# Altium schematic sheet Top Level Schematic.SchDoc
size E; DocumentNumber: 1; SheetNumber: 1; SheetTotal: 4
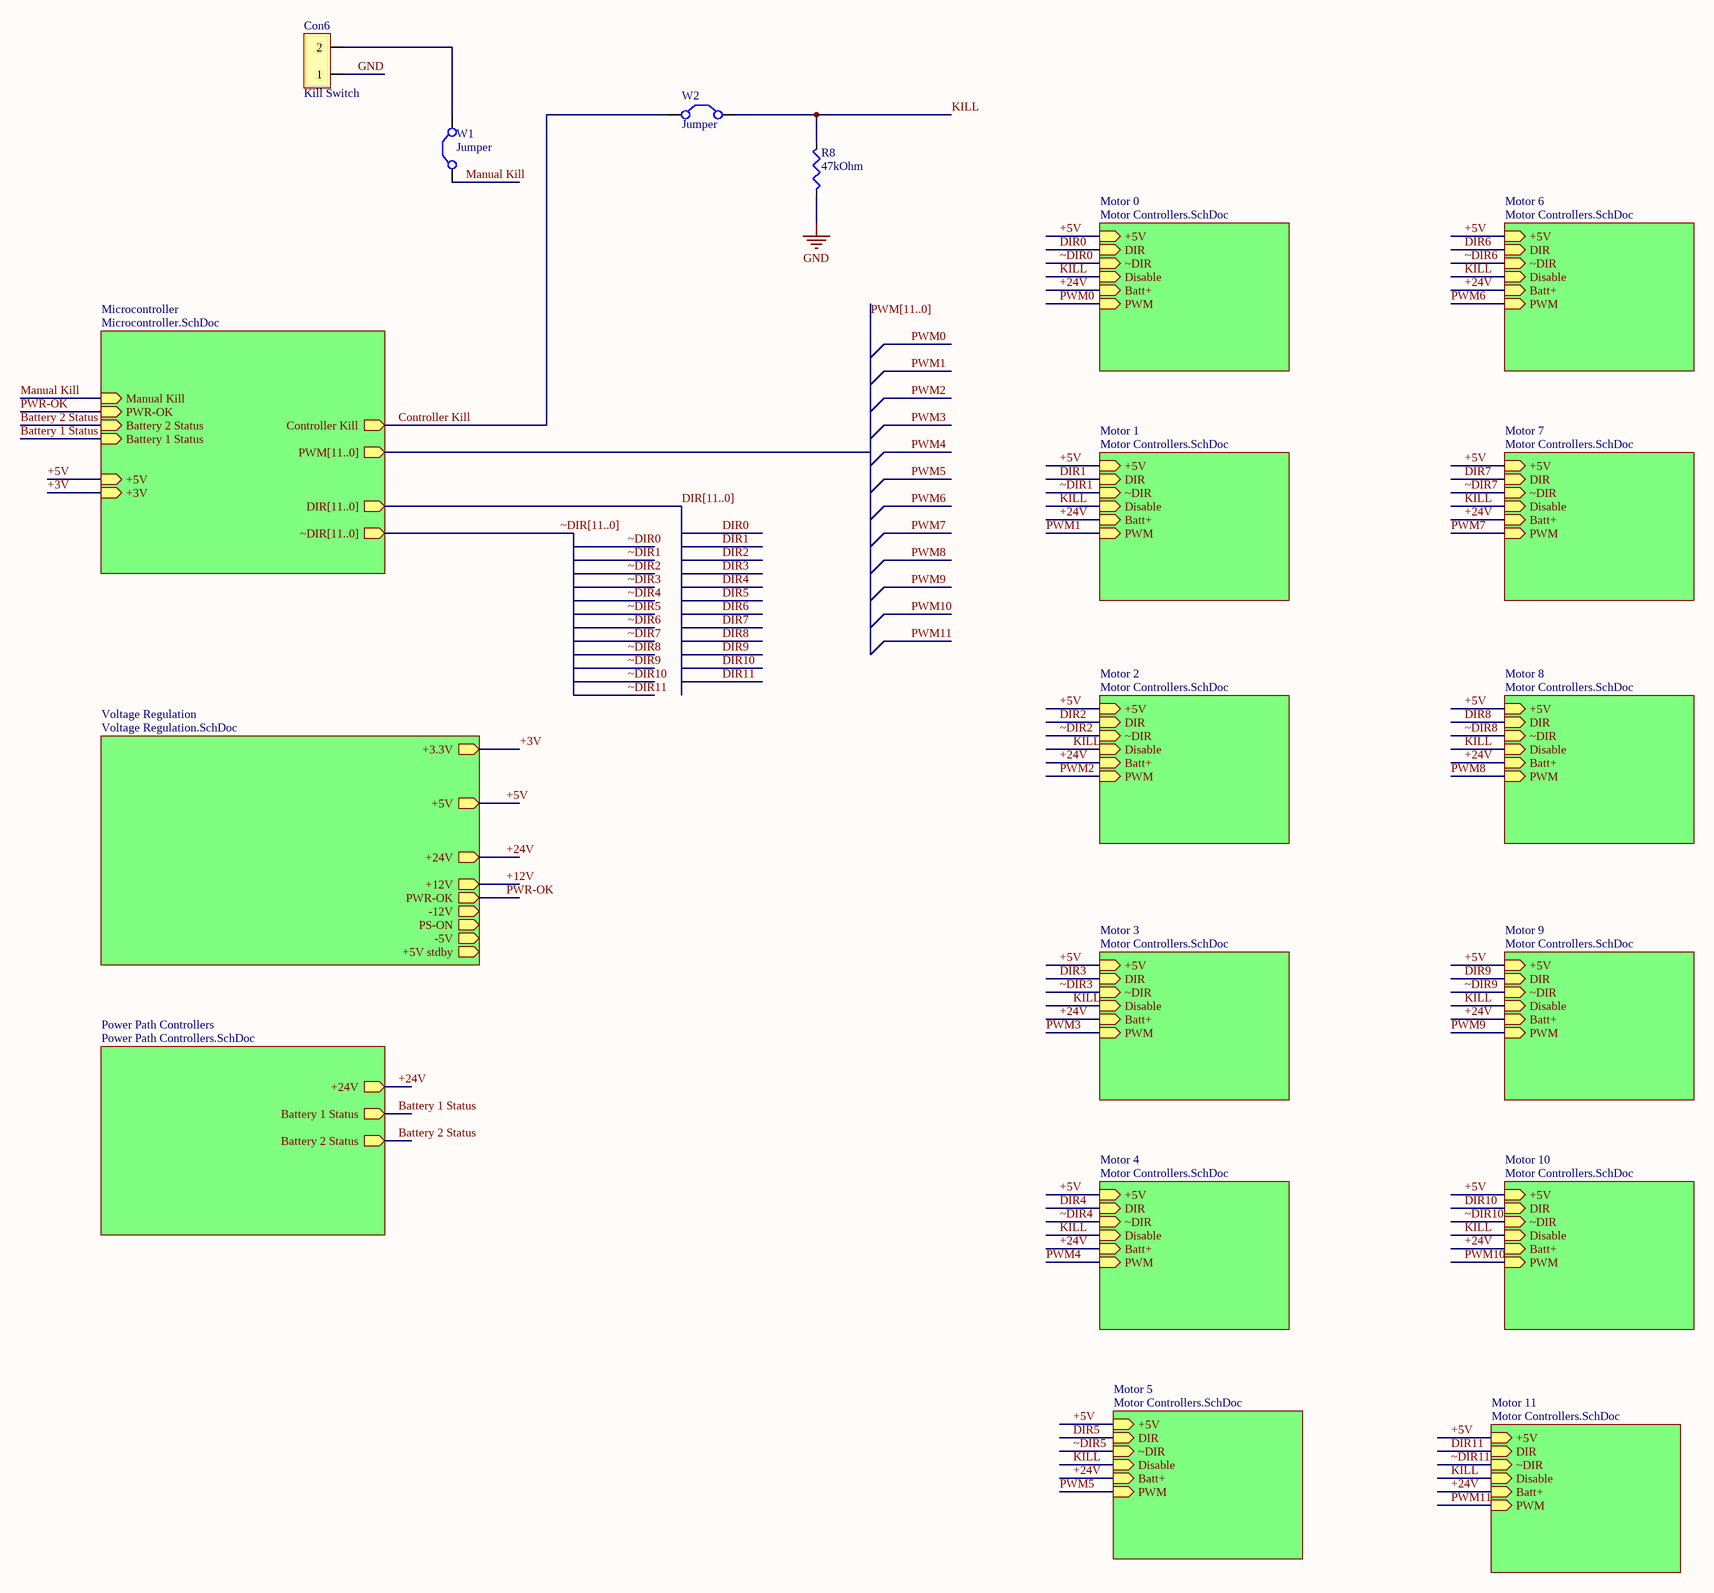
[diagram p0: Top Level Schematic.SchDoc]

## Parts
Con6  Kill Switch  [5569 Mini-Fit Jr 2-Pos Right Angle w/ PCB Mounting Flange]
R8  47kOhm  [R 1210 (3225) RESISTOR]
W1  Jumper  [RAD-0.2]
W2  Jumper  [RAD-0.2]

## Sub-sheets
Microcontroller = Microcontroller.SchDoc: PWM[11..0] (out), DIR[11..0] (out), +5V (in), ~DIR[11..0] (out), +3V (in), Controller Kill (out), Battery 1 Status (in), Battery 2 Status (in), PWR-OK (in), Manual Kill (in)
Motor 0 = Motor Controllers.SchDoc: DIR (in), ~DIR (in), Disable (in), Batt+ (in), PWM (in), +5V (in)
Motor 1 = Motor Controllers.SchDoc: DIR (in), ~DIR (in), Disable (in), Batt+ (in), PWM (in), +5V (in)
Motor 2 = Motor Controllers.SchDoc: DIR (in), ~DIR (in), Disable (in), Batt+ (in), PWM (in), +5V (in)
Motor 3 = Motor Controllers.SchDoc: DIR (in), ~DIR (in), Disable (in), Batt+ (in), PWM (in), +5V (in)
Motor 4 = Motor Controllers.SchDoc: DIR (in), ~DIR (in), Disable (in), Batt+ (in), PWM (in), +5V (in)
Motor 5 = Motor Controllers.SchDoc: DIR (in), ~DIR (in), Disable (in), Batt+ (in), PWM (in), +5V (in)
Motor 6 = Motor Controllers.SchDoc: DIR (in), ~DIR (in), Disable (in), Batt+ (in), PWM (in), +5V (in)
Motor 7 = Motor Controllers.SchDoc: DIR (in), ~DIR (in), Disable (in), Batt+ (in), PWM (in), +5V (in)
Motor 8 = Motor Controllers.SchDoc: DIR (in), ~DIR (in), Disable (in), Batt+ (in), PWM (in), +5V (in)
Motor 9 = Motor Controllers.SchDoc: DIR (in), ~DIR (in), Disable (in), Batt+ (in), PWM (in), +5V (in)
Motor 10 = Motor Controllers.SchDoc: DIR (in), ~DIR (in), Disable (in), Batt+ (in), PWM (in), +5V (in)
Motor 11 = Motor Controllers.SchDoc: DIR (in), ~DIR (in), Disable (in), Batt+ (in), PWM (in), +5V (in)
Power Path Controllers = Power Path Controllers.SchDoc: +24V (out), Battery 1 Status (out), Battery 2 Status (out)
Voltage Regulation = Voltage Regulation.SchDoc: +3.3V (out), +5V (out), +12V (out), PWR-OK (out), -12V (out), PS-ON (out), -5V (out), +5V stdby (out), +24V (out)

## Nets
GND: Con6.1 R8.1
+3V: sheet Microcontroller/+3V, sheet Voltage Regulation/+3.3V
+5V: sheet Microcontroller/+5V, sheet Motor 0/+5V, sheet Motor 1/+5V, sheet Motor 2/+5V, sheet Motor 3/+5V, sheet Motor 4/+5V, sheet Motor 5/+5V, sheet Motor 6/+5V, sheet Motor 7/+5V, sheet Motor 8/+5V, sheet Motor 9/+5V, sheet Motor 11/+5V, sheet Motor 10/+5V, sheet Voltage Regulation/+5V
+12V: sheet Voltage Regulation/+12V
+24V: sheet Motor 0/Batt+, sheet Motor 1/Batt+, sheet Motor 2/Batt+, sheet Motor 3/Batt+, sheet Motor 4/Batt+, sheet Motor 5/Batt+, sheet Motor 6/Batt+, sheet Motor 7/Batt+, sheet Motor 8/Batt+, sheet Motor 9/Batt+, sheet Motor 11/Batt+, sheet Motor 10/Batt+, sheet Voltage Regulation/+24V, sheet Power Path Controllers/+24V
Battery 1 Status: sheet Microcontroller/Battery 1 Status, sheet Power Path Controllers/Battery 1 Status
Battery 2 Status: sheet Microcontroller/Battery 2 Status, sheet Power Path Controllers/Battery 2 Status
Controller Kill: W2.1(C1) ; sheet Microcontroller/Controller Kill
DIR0: sheet Motor 0/DIR
DIR1: sheet Motor 1/DIR
DIR2: sheet Motor 2/DIR
DIR3: sheet Motor 3/DIR
DIR4: sheet Motor 4/DIR
DIR5: sheet Motor 5/DIR
DIR6: sheet Motor 6/DIR
DIR7: sheet Motor 7/DIR
DIR8: sheet Motor 8/DIR
DIR9: sheet Motor 9/DIR
DIR10: sheet Motor 10/DIR
DIR11: sheet Motor 11/DIR
KILL: R8.2 W2.2(C2) ; sheet Motor 0/Disable, sheet Motor 1/Disable, sheet Motor 2/Disable, sheet Motor 3/Disable, sheet Motor 4/Disable, sheet Motor 5/Disable, sheet Motor 6/Disable, sheet Motor 7/Disable, sheet Motor 8/Disable, sheet Motor 9/Disable, sheet Motor 11/Disable, sheet Motor 10/Disable
Manual Kill: W1.1(C1) ; sheet Microcontroller/Manual Kill
PWM0: sheet Motor 0/PWM
PWM1: sheet Motor 1/PWM
PWM2: sheet Motor 2/PWM
PWM3: sheet Motor 3/PWM
PWM4: sheet Motor 4/PWM
PWM5: sheet Motor 5/PWM
PWM6: sheet Motor 6/PWM
PWM7: sheet Motor 7/PWM
PWM8: sheet Motor 8/PWM
PWM9: sheet Motor 9/PWM
PWM10: sheet Motor 10/PWM
PWM11: sheet Motor 11/PWM
PWR-OK: sheet Microcontroller/PWR-OK, sheet Voltage Regulation/PWR-OK
~DIR0: sheet Motor 0/~DIR
~DIR1: sheet Motor 1/~DIR
~DIR2: sheet Motor 2/~DIR
~DIR3: sheet Motor 3/~DIR
~DIR4: sheet Motor 4/~DIR
~DIR5: sheet Motor 5/~DIR
~DIR6: sheet Motor 6/~DIR
~DIR7: sheet Motor 7/~DIR
~DIR8: sheet Motor 8/~DIR
~DIR9: sheet Motor 9/~DIR
~DIR10: sheet Motor 10/~DIR
~DIR11: sheet Motor 11/~DIR
NetCon6_2: Con6.2 W1.2(C2)

## Buses and harness runs
bus DIR[11..0] = sheet Microcontroller/DIR[11..0]
bus PWM[11..0] = sheet Microcontroller/PWM[11..0]
bus ~DIR[11..0] = sheet Microcontroller/~DIR[11..0]

## Library data of the parts
Con6 = 5569 Mini-Fit Jr 2-Pos Right Angle
R8 = Resistor: Value: 0Ohm
W1 W2 = Jumper: Jumper Wire; Published: 24-Mar-1999; LatestRevisionDate: 17-Jul-2002; LatestRevisionNote: Re-released for DXP Platform.; PackageReference: RAD-0.2; Publisher: Altium Limited